# EAGLE schematic Schematic (EAGLE 9.6.2)
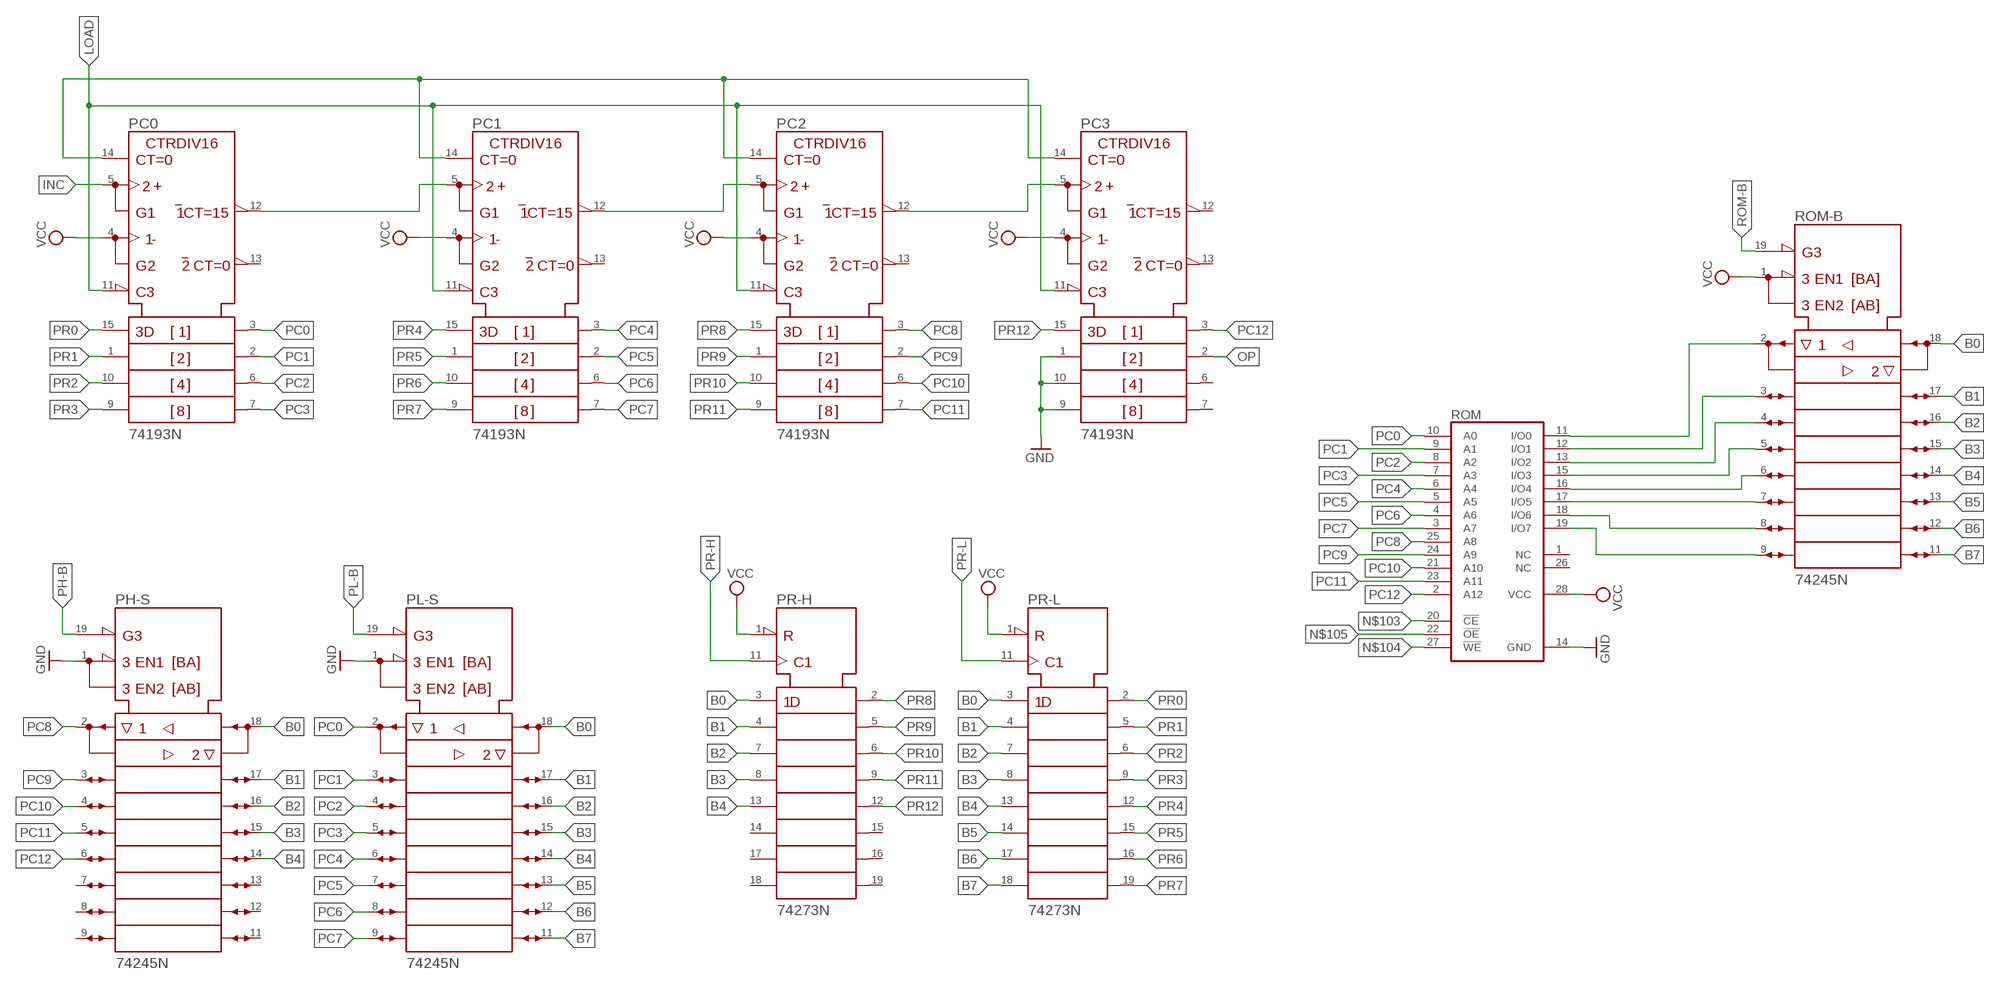
[diagram p0: schematic, sheet 1, part 1 of 3]
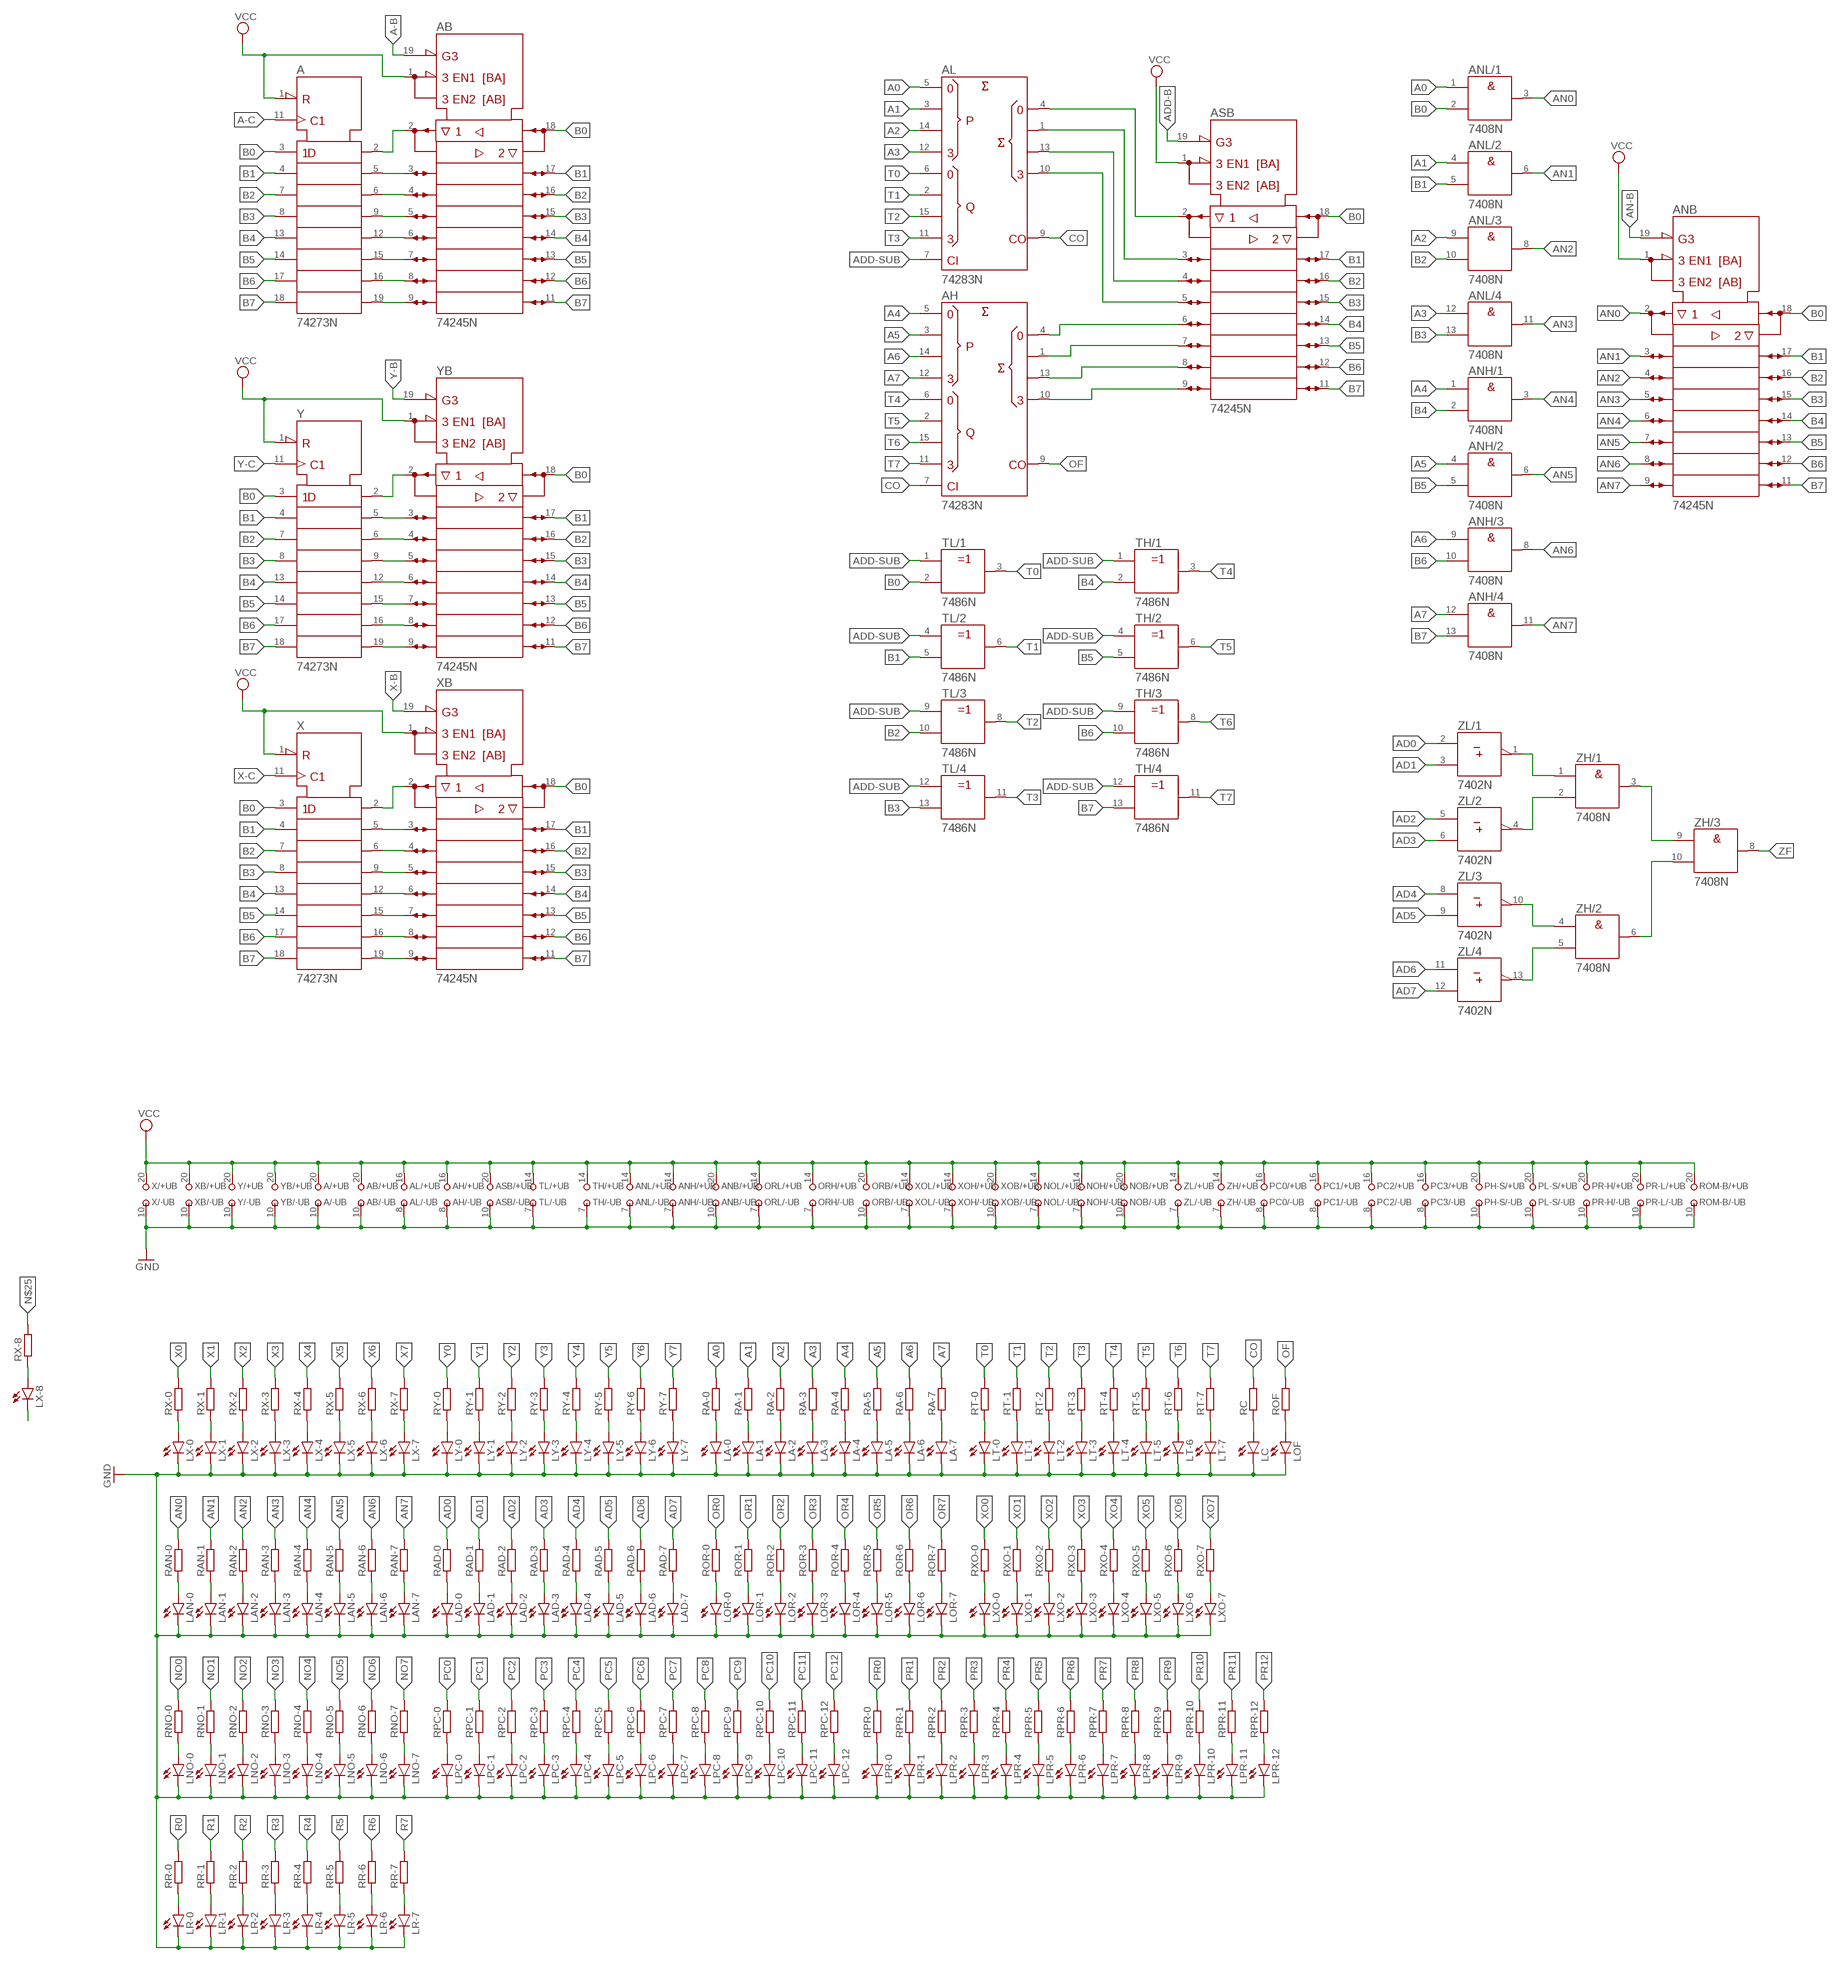
[diagram p1: schematic, sheet 1, part 2 of 3]
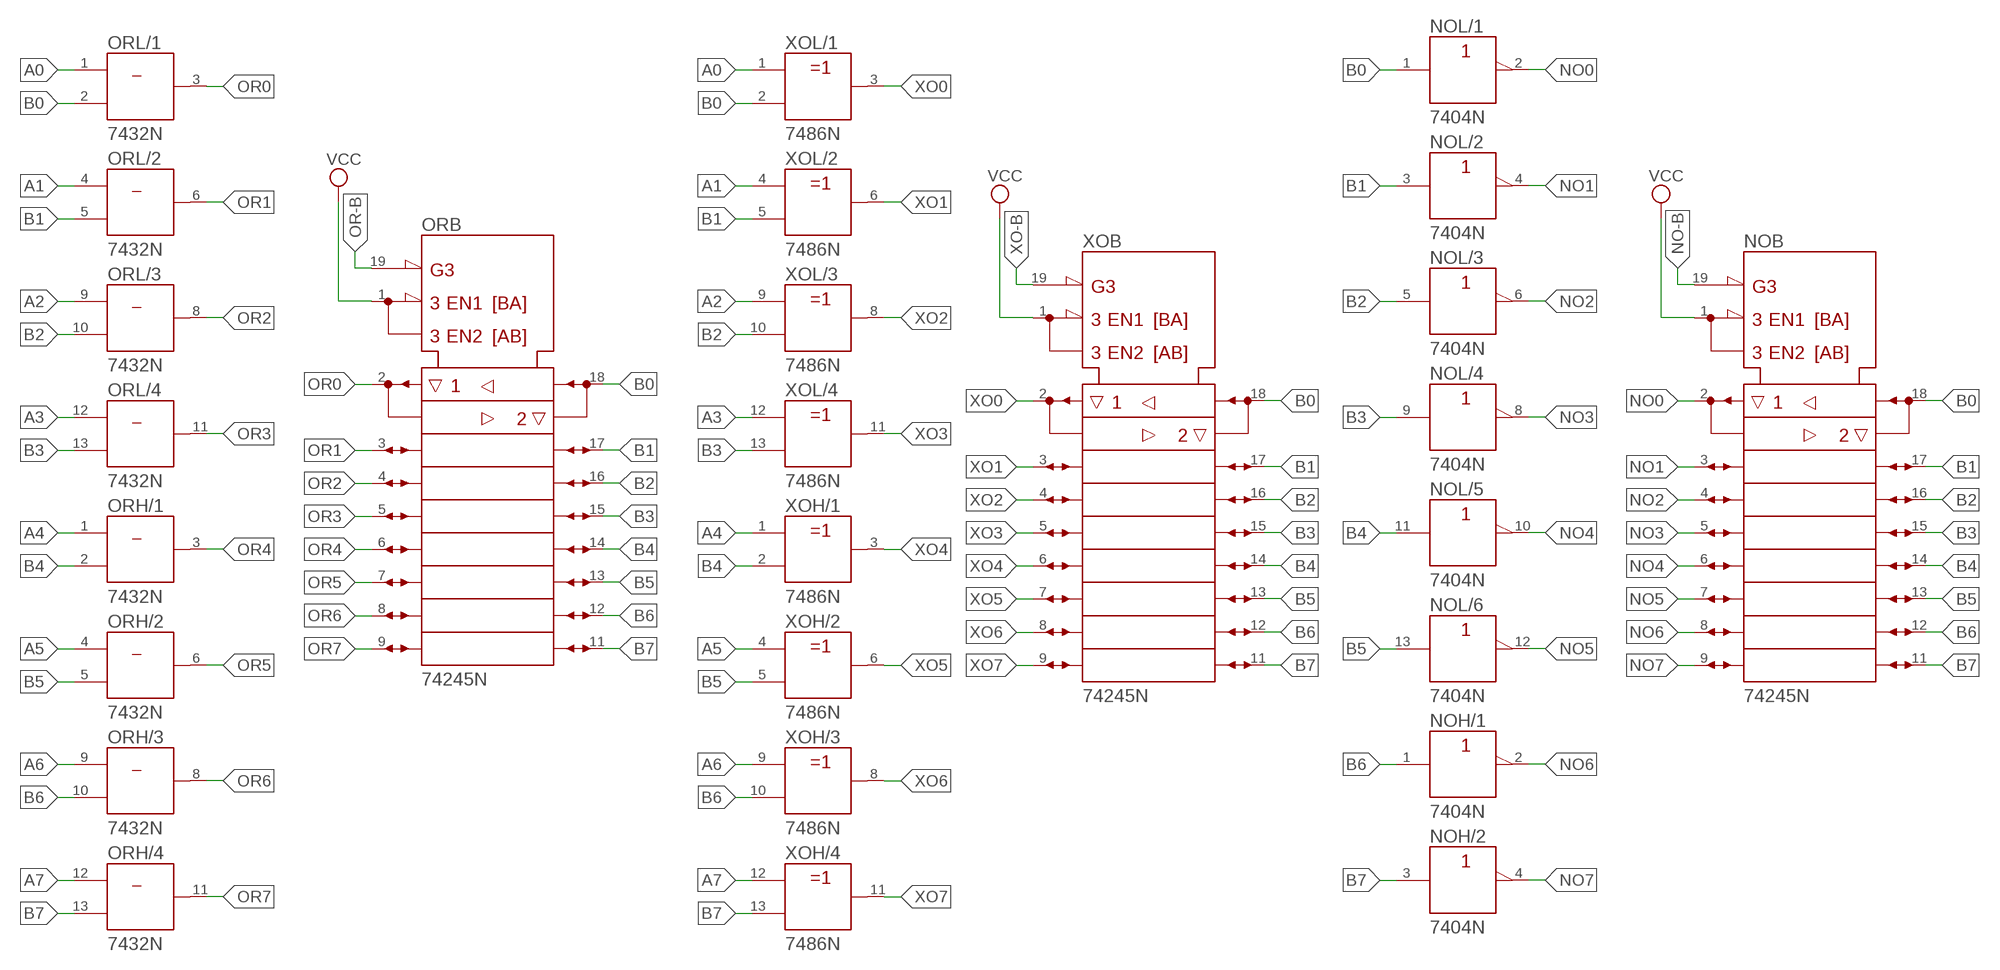
[diagram p2: schematic, sheet 1, part 3 of 3]

## Parts
A  74273N  [DIL20]
AB  74245N  [DIL20]
AH  74283N  [DIL16]
AL  74283N  [DIL16]
ANB  74245N  [DIL20]
ANH  7408N  [DIL14]
ANL  7408N  [DIL14]
ASB  74245N  [DIL20]
LA-0  LED5MM  [LED5MM]
LA-1  LED5MM  [LED5MM]
LA-2  LED5MM  [LED5MM]
LA-3  LED5MM  [LED5MM]
LA-4  LED5MM  [LED5MM]
LA-5  LED5MM  [LED5MM]
LA-6  LED5MM  [LED5MM]
LA-7  LED5MM  [LED5MM]
LAD-0  LED5MM  [LED5MM]
LAD-1  LED5MM  [LED5MM]
LAD-2  LED5MM  [LED5MM]
LAD-3  LED5MM  [LED5MM]
LAD-4  LED5MM  [LED5MM]
LAD-5  LED5MM  [LED5MM]
LAD-6  LED5MM  [LED5MM]
LAD-7  LED5MM  [LED5MM]
LAN-0  LED5MM  [LED5MM]
LAN-1  LED5MM  [LED5MM]
LAN-2  LED5MM  [LED5MM]
LAN-3  LED5MM  [LED5MM]
LAN-4  LED5MM  [LED5MM]
LAN-5  LED5MM  [LED5MM]
LAN-6  LED5MM  [LED5MM]
LAN-7  LED5MM  [LED5MM]
LC  LED5MM  [LED5MM]
LNO-0  LED5MM  [LED5MM]
LNO-1  LED5MM  [LED5MM]
LNO-2  LED5MM  [LED5MM]
LNO-3  LED5MM  [LED5MM]
LNO-4  LED5MM  [LED5MM]
LNO-5  LED5MM  [LED5MM]
LNO-6  LED5MM  [LED5MM]
LNO-7  LED5MM  [LED5MM]
LOF  LED5MM  [LED5MM]
LOR-0  LED5MM  [LED5MM]
LOR-1  LED5MM  [LED5MM]
LOR-2  LED5MM  [LED5MM]
LOR-3  LED5MM  [LED5MM]
LOR-4  LED5MM  [LED5MM]
LOR-5  LED5MM  [LED5MM]
LOR-6  LED5MM  [LED5MM]
LOR-7  LED5MM  [LED5MM]
LPC-0  LED5MM  [LED5MM]
LPC-1  LED5MM  [LED5MM]
LPC-2  LED5MM  [LED5MM]
LPC-3  LED5MM  [LED5MM]
LPC-4  LED5MM  [LED5MM]
LPC-5  LED5MM  [LED5MM]
LPC-6  LED5MM  [LED5MM]
LPC-7  LED5MM  [LED5MM]
LPC-8  LED5MM  [LED5MM]
LPC-9  LED5MM  [LED5MM]
LPC-10  LED5MM  [LED5MM]
LPC-11  LED5MM  [LED5MM]
LPC-12  LED5MM  [LED5MM]
LPR-0  LED5MM  [LED5MM]
LPR-1  LED5MM  [LED5MM]
LPR-2  LED5MM  [LED5MM]
LPR-3  LED5MM  [LED5MM]
LPR-4  LED5MM  [LED5MM]
LPR-5  LED5MM  [LED5MM]
LPR-6  LED5MM  [LED5MM]
LPR-7  LED5MM  [LED5MM]
LPR-8  LED5MM  [LED5MM]
LPR-9  LED5MM  [LED5MM]
LPR-10  LED5MM  [LED5MM]
LPR-11  LED5MM  [LED5MM]
LPR-12  LED5MM  [LED5MM]
LR-0  LED5MM  [LED5MM]
LR-1  LED5MM  [LED5MM]
LR-2  LED5MM  [LED5MM]
LR-3  LED5MM  [LED5MM]
LR-4  LED5MM  [LED5MM]
LR-5  LED5MM  [LED5MM]
LR-6  LED5MM  [LED5MM]
LR-7  LED5MM  [LED5MM]
LT-0  LED5MM  [LED5MM]
LT-1  LED5MM  [LED5MM]
LT-2  LED5MM  [LED5MM]
LT-3  LED5MM  [LED5MM]
LT-4  LED5MM  [LED5MM]
LT-5  LED5MM  [LED5MM]
LT-6  LED5MM  [LED5MM]
LT-7  LED5MM  [LED5MM]
LX-0  LED5MM  [LED5MM]
LX-1  LED5MM  [LED5MM]
LX-2  LED5MM  [LED5MM]
LX-3  LED5MM  [LED5MM]
LX-4  LED5MM  [LED5MM]
LX-5  LED5MM  [LED5MM]
LX-6  LED5MM  [LED5MM]
LX-7  LED5MM  [LED5MM]
LX-8  LED5MM  [LED5MM]
LXO-0  LED5MM  [LED5MM]
LXO-1  LED5MM  [LED5MM]
LXO-2  LED5MM  [LED5MM]
LXO-3  LED5MM  [LED5MM]
LXO-4  LED5MM  [LED5MM]
LXO-5  LED5MM  [LED5MM]
LXO-6  LED5MM  [LED5MM]
LXO-7  LED5MM  [LED5MM]
LY-0  LED5MM  [LED5MM]
LY-1  LED5MM  [LED5MM]
LY-2  LED5MM  [LED5MM]
LY-3  LED5MM  [LED5MM]
LY-4  LED5MM  [LED5MM]
LY-5  LED5MM  [LED5MM]
LY-6  LED5MM  [LED5MM]
LY-7  LED5MM  [LED5MM]
NOB  74245N  [DIL20]
NOH  7404N  [DIL14]
NOL  7404N  [DIL14]
ORB  74245N  [DIL20]
ORH  7432N  [DIL14]
ORL  7432N  [DIL14]
PC0  74193N  [DIL16]
PC1  74193N  [DIL16]
PC2  74193N  [DIL16]
PC3  74193N  [DIL16]
PH-S  74245N  [DIL20]
PL-S  74245N  [DIL20]
PR-H  74273N  [DIL20]
PR-L  74273N  [DIL20]
RA-0  R-EU_0207/10  [0207/10]
RA-1  R-EU_0207/10  [0207/10]
RA-2  R-EU_0207/10  [0207/10]
RA-3  R-EU_0207/10  [0207/10]
RA-4  R-EU_0207/10  [0207/10]
RA-5  R-EU_0207/10  [0207/10]
RA-6  R-EU_0207/10  [0207/10]
RA-7  R-EU_0207/10  [0207/10]
RAD-0  R-EU_0207/10  [0207/10]
RAD-1  R-EU_0207/10  [0207/10]
RAD-2  R-EU_0207/10  [0207/10]
RAD-3  R-EU_0207/10  [0207/10]
RAD-4  R-EU_0207/10  [0207/10]
RAD-5  R-EU_0207/10  [0207/10]
RAD-6  R-EU_0207/10  [0207/10]
RAD-7  R-EU_0207/10  [0207/10]
RAN-0  R-EU_0207/10  [0207/10]
RAN-1  R-EU_0207/10  [0207/10]
RAN-2  R-EU_0207/10  [0207/10]
RAN-3  R-EU_0207/10  [0207/10]
RAN-4  R-EU_0207/10  [0207/10]
RAN-5  R-EU_0207/10  [0207/10]
RAN-6  R-EU_0207/10  [0207/10]
RAN-7  R-EU_0207/10  [0207/10]
RC  R-EU_0207/10  [0207/10]
RNO-0  R-EU_0207/10  [0207/10]
RNO-1  R-EU_0207/10  [0207/10]
RNO-2  R-EU_0207/10  [0207/10]
RNO-3  R-EU_0207/10  [0207/10]
RNO-4  R-EU_0207/10  [0207/10]
RNO-5  R-EU_0207/10  [0207/10]
RNO-6  R-EU_0207/10  [0207/10]
RNO-7  R-EU_0207/10  [0207/10]
ROF  R-EU_0207/10  [0207/10]
ROM  28C64C  [DIL28-6]
ROM-B  74245N  [DIL20]
ROR-0  R-EU_0207/10  [0207/10]
ROR-1  R-EU_0207/10  [0207/10]
ROR-2  R-EU_0207/10  [0207/10]
ROR-3  R-EU_0207/10  [0207/10]
ROR-4  R-EU_0207/10  [0207/10]
ROR-5  R-EU_0207/10  [0207/10]
ROR-6  R-EU_0207/10  [0207/10]
ROR-7  R-EU_0207/10  [0207/10]
RPC-0  R-EU_0207/10  [0207/10]
RPC-1  R-EU_0207/10  [0207/10]
RPC-2  R-EU_0207/10  [0207/10]
RPC-3  R-EU_0207/10  [0207/10]
RPC-4  R-EU_0207/10  [0207/10]
RPC-5  R-EU_0207/10  [0207/10]
RPC-6  R-EU_0207/10  [0207/10]
RPC-7  R-EU_0207/10  [0207/10]
RPC-8  R-EU_0207/10  [0207/10]
RPC-9  R-EU_0207/10  [0207/10]
RPC-10  R-EU_0207/10  [0207/10]
RPC-11  R-EU_0207/10  [0207/10]
RPC-12  R-EU_0207/10  [0207/10]
RPR-0  R-EU_0207/10  [0207/10]
RPR-1  R-EU_0207/10  [0207/10]
RPR-2  R-EU_0207/10  [0207/10]
RPR-3  R-EU_0207/10  [0207/10]
RPR-4  R-EU_0207/10  [0207/10]
RPR-5  R-EU_0207/10  [0207/10]
RPR-6  R-EU_0207/10  [0207/10]
RPR-7  R-EU_0207/10  [0207/10]
RPR-8  R-EU_0207/10  [0207/10]
RPR-9  R-EU_0207/10  [0207/10]
RPR-10  R-EU_0207/10  [0207/10]
RPR-11  R-EU_0207/10  [0207/10]
RPR-12  R-EU_0207/10  [0207/10]
RR-0  R-EU_0207/10  [0207/10]
RR-1  R-EU_0207/10  [0207/10]
RR-2  R-EU_0207/10  [0207/10]
RR-3  R-EU_0207/10  [0207/10]
RR-4  R-EU_0207/10  [0207/10]
RR-5  R-EU_0207/10  [0207/10]
RR-6  R-EU_0207/10  [0207/10]
RR-7  R-EU_0207/10  [0207/10]
RT-0  R-EU_0207/10  [0207/10]
RT-1  R-EU_0207/10  [0207/10]
RT-2  R-EU_0207/10  [0207/10]
RT-3  R-EU_0207/10  [0207/10]
RT-4  R-EU_0207/10  [0207/10]
RT-5  R-EU_0207/10  [0207/10]
RT-6  R-EU_0207/10  [0207/10]
RT-7  R-EU_0207/10  [0207/10]
RX-0  R-EU_0207/10  [0207/10]
RX-1  R-EU_0207/10  [0207/10]
RX-2  R-EU_0207/10  [0207/10]
RX-3  R-EU_0207/10  [0207/10]
RX-4  R-EU_0207/10  [0207/10]
RX-5  R-EU_0207/10  [0207/10]
RX-6  R-EU_0207/10  [0207/10]
RX-7  R-EU_0207/10  [0207/10]
RX-8  R-EU_0207/10  [0207/10]
RXO-0  R-EU_0207/10  [0207/10]
RXO-1  R-EU_0207/10  [0207/10]
RXO-2  R-EU_0207/10  [0207/10]
RXO-3  R-EU_0207/10  [0207/10]
RXO-4  R-EU_0207/10  [0207/10]
RXO-5  R-EU_0207/10  [0207/10]
RXO-6  R-EU_0207/10  [0207/10]
RXO-7  R-EU_0207/10  [0207/10]
RY-0  R-EU_0207/10  [0207/10]
RY-1  R-EU_0207/10  [0207/10]
RY-2  R-EU_0207/10  [0207/10]
RY-3  R-EU_0207/10  [0207/10]
RY-4  R-EU_0207/10  [0207/10]
RY-5  R-EU_0207/10  [0207/10]
RY-6  R-EU_0207/10  [0207/10]
RY-7  R-EU_0207/10  [0207/10]
TH  7486N  [DIL14]
TL  7486N  [DIL14]
X  74273N  [DIL20]
XB  74245N  [DIL20]
XOB  74245N  [DIL20]
XOH  7486N  [DIL14]
XOL  7486N  [DIL14]
Y  74273N  [DIL20]
YB  74245N  [DIL20]
ZH  7408N  [DIL14]
ZL  7402N  [DIL14]

## Nets
A0: A.2(1Q) AB.2(A1) AL.5(A1) ANL.1(/1:A) ORL.1(/1:A) RA-0.2 XOL.1(/1:A)
A1: A.5(2Q) AB.3(A2) AL.3(A2) ANL.4(/2:A) ORL.4(/2:A) RA-1.2 XOL.4(/2:A)
A2: A.6(3Q) AB.4(A3) AL.14(A3) ANL.9(/3:A) ORL.9(/3:A) RA-2.2 XOL.9(/3:A)
A3: A.9(4Q) AB.5(A4) AL.12(A4) ANL.12(/4:A) ORL.12(/4:A) RA-3.2 XOL.12(/4:A)
A4: A.12(5Q) AB.6(A5) AH.5(A1) ANH.1(/1:A) ORH.1(/1:A) RA-4.2 XOH.1(/1:A)
A5: A.15(6Q) AB.7(A6) AH.3(A2) ANH.4(/2:A) ORH.4(/2:A) RA-5.2 XOH.4(/2:A)
A6: A.16(7Q) AB.8(A7) AH.14(A3) ANH.9(/3:A) ORH.9(/3:A) RA-6.2 XOH.9(/3:A)
A7: A.19(8Q) AB.9(A8) AH.12(A4) ANH.12(/4:A) ORH.12(/4:A) RA-7.2 XOH.12(/4:A)
A-B: AB.19(!G)
A-C: A.11(CLK)
AD0: AL.4(S1) ASB.2(A1) RAD-0.2 ZL.2(/1:A)
AD1: AL.1(S2) ASB.3(A2) RAD-1.2 ZL.3(/1:B)
AD2: AL.13(S3) ASB.4(A3) RAD-2.2 ZL.5(/2:A)
AD3: AL.10(S4) ASB.5(A4) RAD-3.2 ZL.6(/2:B)
AD4: AH.4(S1) ASB.6(A5) RAD-4.2 ZL.8(/3:A)
AD5: AH.1(S2) ASB.7(A6) RAD-5.2 ZL.9(/3:B)
AD6: AH.13(S3) ASB.8(A7) RAD-6.2 ZL.11(/4:A)
AD7: AH.10(S4) ASB.9(A8) RAD-7.2 ZL.12(/4:B)
ADD-B: ASB.19(!G)
ADD-SUB: AL.7(C0) TH.1(/1:A) TH.4(/2:A) TH.9(/3:A) TH.12(/4:A) TL.1(/1:A) TL.4(/2:A) TL.9(/3:A) TL.12(/4:A)
AN0: ANB.2(A1) ANL.3(/1:Y) RAN-0.2
AN1: ANB.3(A2) ANL.6(/2:Y) RAN-1.2
AN2: ANB.4(A3) ANL.8(/3:Y) RAN-2.2
AN3: ANB.5(A4) ANL.11(/4:Y) RAN-3.2
AN4: ANB.6(A5) ANH.3(/1:Y) RAN-4.2
AN5: ANB.7(A6) ANH.6(/2:Y) RAN-5.2
AN6: ANB.8(A7) ANH.8(/3:Y) RAN-6.2
AN7: ANB.9(A8) ANH.11(/4:Y) RAN-7.2
AN-B: ANB.19(!G)
B0: A.3(1D) AB.18(B1) ANB.18(B1) ANL.2(/1:B) ASB.18(B1) NOB.18(B1) NOL.1(/1:A) ORB.18(B1) ORL.2(/1:B) PH-S.18(B1) PL-S.18(B1) PR-H.3(1D) PR-L.3(1D) ROM-B.18(B1) TL.2(/1:B) X.3(1D) XB.18(B1) XOB.18(B1) XOL.2(/1:B) Y.3(1D) YB.18(B1)
B1: A.4(2D) AB.17(B2) ANB.17(B2) ANL.5(/2:B) ASB.17(B2) NOB.17(B2) NOL.3(/2:A) ORB.17(B2) ORL.5(/2:B) PH-S.17(B2) PL-S.17(B2) PR-H.4(2D) PR-L.4(2D) ROM-B.17(B2) TL.5(/2:B) X.4(2D) XB.17(B2) XOB.17(B2) XOL.5(/2:B) Y.4(2D) YB.17(B2)
B2: A.7(3D) AB.16(B3) ANB.16(B3) ANL.10(/3:B) ASB.16(B3) NOB.16(B3) NOL.5(/3:A) ORB.16(B3) ORL.10(/3:B) PH-S.16(B3) PL-S.16(B3) PR-H.7(3D) PR-L.7(3D) ROM-B.16(B3) TL.10(/3:B) X.7(3D) XB.16(B3) XOB.16(B3) XOL.10(/3:B) Y.7(3D) YB.16(B3)
B3: A.8(4D) AB.15(B4) ANB.15(B4) ANL.13(/4:B) ASB.15(B4) NOB.15(B4) NOL.9(/4:A) ORB.15(B4) ORL.13(/4:B) PH-S.15(B4) PL-S.15(B4) PR-H.8(4D) PR-L.8(4D) ROM-B.15(B4) TL.13(/4:B) X.8(4D) XB.15(B4) XOB.15(B4) XOL.13(/4:B) Y.8(4D) YB.15(B4)
B4: A.13(5D) AB.14(B5) ANB.14(B5) ANH.2(/1:B) ASB.14(B5) NOB.14(B5) NOL.11(/5:A) ORB.14(B5) ORH.2(/1:B) PH-S.14(B5) PL-S.14(B5) PR-H.13(5D) PR-L.13(5D) ROM-B.14(B5) TH.2(/1:B) X.13(5D) XB.14(B5) XOB.14(B5) XOH.2(/1:B) Y.13(5D) YB.14(B5)
B5: A.14(6D) AB.13(B6) ANB.13(B6) ANH.5(/2:B) ASB.13(B6) NOB.13(B6) NOL.13(/6:A) ORB.13(B6) ORH.5(/2:B) PL-S.13(B6) PR-L.14(6D) ROM-B.13(B6) TH.5(/2:B) X.14(6D) XB.13(B6) XOB.13(B6) XOH.5(/2:B) Y.14(6D) YB.13(B6)
B6: A.17(7D) AB.12(B7) ANB.12(B7) ANH.10(/3:B) ASB.12(B7) NOB.12(B7) NOH.1(/1:A) ORB.12(B7) ORH.10(/3:B) PL-S.12(B7) PR-L.17(7D) ROM-B.12(B7) TH.10(/3:B) X.17(7D) XB.12(B7) XOB.12(B7) XOH.10(/3:B) Y.17(7D) YB.12(B7)
B7: A.18(8D) AB.11(B8) ANB.11(B8) ANH.13(/4:B) ASB.11(B8) NOB.11(B8) NOH.3(/2:A) ORB.11(B8) ORH.13(/4:B) PL-S.11(B8) PR-L.18(8D) ROM-B.11(B8) TH.13(/4:B) X.18(8D) XB.11(B8) XOB.11(B8) XOH.13(/4:B) Y.18(8D) YB.11(B8)
CO: AH.7(C0) AL.9(C4) RC.2
GND: A.10(-UB) AB.10(-UB) AH.8(-UB) AL.8(-UB) ANB.10(-UB) ANH.7(/-UB:-UB) ANL.7(/-UB:-UB) ASB.10(-UB) LA-0.K(C) LA-1.K(C) LA-2.K(C) LA-3.K(C) LA-4.K(C) LA-5.K(C) LA-6.K(C) LA-7.K(C) LAD-0.K(C) LAD-1.K(C) LAD-2.K(C) LAD-3.K(C) LAD-4.K(C) LAD-5.K(C) LAD-6.K(C) LAD-7.K(C) LAN-0.K(C) LAN-1.K(C) LAN-2.K(C) LAN-3.K(C) LAN-4.K(C) LAN-5.K(C) LAN-6.K(C) LAN-7.K(C) LC.K(C) LNO-0.K(C) LNO-1.K(C) LNO-2.K(C) LNO-3.K(C) LNO-4.K(C) LNO-5.K(C) LNO-6.K(C) LNO-7.K(C) LOF.K(C) LOR-0.K(C) LOR-1.K(C) LOR-2.K(C) LOR-3.K(C) LOR-4.K(C) LOR-5.K(C) LOR-6.K(C) LOR-7.K(C) LPC-0.K(C) LPC-1.K(C) LPC-2.K(C) LPC-3.K(C) LPC-4.K(C) LPC-5.K(C) LPC-6.K(C) LPC-7.K(C) LPC-8.K(C) LPC-9.K(C) LPC-10.K(C) LPC-11.K(C) LPC-12.K(C) LPR-0.K(C) LPR-1.K(C) LPR-2.K(C) LPR-3.K(C) LPR-4.K(C) LPR-5.K(C) LPR-6.K(C) LPR-7.K(C) LPR-8.K(C) LPR-9.K(C) LPR-10.K(C) LPR-11.K(C) LPR-12.K(C) LR-0.K(C) LR-1.K(C) LR-2.K(C) LR-3.K(C) LR-4.K(C) LR-5.K(C) LR-6.K(C) LR-7.K(C) LT-0.K(C) LT-1.K(C) LT-2.K(C) LT-3.K(C) LT-4.K(C) LT-5.K(C) LT-6.K(C) LT-7.K(C) LX-0.K(C) LX-1.K(C) LX-2.K(C) LX-3.K(C) LX-4.K(C) LX-5.K(C) LX-6.K(C) LX-7.K(C) LXO-0.K(C) LXO-1.K(C) LXO-2.K(C) LXO-3.K(C) LXO-4.K(C) LXO-5.K(C) LXO-6.K(C) LXO-7.K(C) LY-0.K(C) LY-1.K(C) LY-2.K(C) LY-3.K(C) LY-4.K(C) LY-5.K(C) LY-6.K(C) LY-7.K(C) NOB.10(-UB) NOH.7(/-UB:-UB) NOL.7(/-UB:-UB) ORB.10(-UB) ORH.7(/-UB:-UB) ORL.7(/-UB:-UB) PC0.8(-UB) PC1.8(-UB) PC2.8(-UB) PC3.1(B) PC3.8(-UB) PC3.9(D) PC3.10(C) PH-S.1(DIR) PH-S.10(-UB) PL-S.1(DIR) PL-S.10(-UB) PR-H.10(-UB) PR-L.10(-UB) ROM-B.10(-UB) ROM.14(GND) TH.7(/-UB:-UB) TL.7(/-UB:-UB) X.10(-UB) XB.10(-UB) XOB.10(-UB) XOH.7(/-UB:-UB) XOL.7(/-UB:-UB) Y.10(-UB) YB.10(-UB) ZH.7(/-UB:-UB) ZL.7(/-UB:-UB)
GND1: LX-8.K(C)
INC: PC0.5(UP)
LOAD: PC0.11(!LOAD) PC1.11(!LOAD) PC2.11(!LOAD) PC3.11(!LOAD)
N$1: LC.A RC.1
N$2: LX-0.A RX-0.1
N$3: LA-0.A RA-0.1
N$4: LT-0.A RT-0.1
N$5: LX-1.A RX-1.1
N$6: LY-0.A RY-0.1
N$7: LA-1.A RA-1.1
N$8: LX-2.A RX-2.1
N$9: LOF.A ROF.1
N$10: LA-2.A RA-2.1
N$11: LX-3.A RX-3.1
N$12: LY-1.A RY-1.1
N$13: LT-1.A RT-1.1
N$14: LX-4.A RX-4.1
N$15: LA-3.A RA-3.1
N$16: LAN-1.A RAN-1.1
N$17: LX-5.A RX-5.1
N$18: LY-2.A RY-2.1
N$19: LA-4.A RA-4.1
N$20: LX-6.A RX-6.1
N$21: LT-2.A RT-2.1
N$22: LA-5.A RA-5.1
N$23: LX-7.A RX-7.1
N$24: LY-3.A RY-3.1
N$25: RX-8.2
N$26: LX-8.A RX-8.1
N$27: LAN-0.A RAN-0.1
N$28: LY-4.A RY-4.1
N$29: LA-6.A RA-6.1
N$30: LY-5.A RY-5.1
N$31: LT-3.A RT-3.1
N$32: LY-6.A RY-6.1
N$33: LA-7.A RA-7.1
N$34: LY-7.A RY-7.1
N$35: LAN-2.A RAN-2.1
N$36: LT-4.A RT-4.1
N$37: LAN-3.A RAN-3.1
N$38: LT-5.A RT-5.1
N$39: LAN-4.A RAN-4.1
N$40: LT-6.A RT-6.1
N$41: LAN-5.A RAN-5.1
N$42: LT-7.A RT-7.1
N$43: LAN-6.A RAN-6.1
N$44: LAN-7.A RAN-7.1
N$45: LAD-0.A RAD-0.1
N$46: LAD-1.A RAD-1.1
N$47: LAD-2.A RAD-2.1
N$48: LAD-3.A RAD-3.1
N$49: LAD-4.A RAD-4.1
N$50: LAD-5.A RAD-5.1
N$51: LAD-6.A RAD-6.1
N$52: LAD-7.A RAD-7.1
N$53: LXO-0.A RXO-0.1
N$54: LXO-1.A RXO-1.1
N$55: LXO-2.A RXO-2.1
N$56: LXO-3.A RXO-3.1
N$57: LXO-4.A RXO-4.1
N$58: LXO-5.A RXO-5.1
N$59: LXO-6.A RXO-6.1
N$60: LXO-7.A RXO-7.1
N$61: LNO-0.A RNO-0.1
N$62: LNO-1.A RNO-1.1
N$63: LNO-2.A RNO-2.1
N$64: LNO-3.A RNO-3.1
N$65: LNO-4.A RNO-4.1
N$66: LNO-5.A RNO-5.1
N$67: LNO-6.A RNO-6.1
N$68: LNO-7.A RNO-7.1
N$69: LPC-0.A RPC-0.1
N$70: LPC-1.A RPC-1.1
N$71: LPC-2.A RPC-2.1
N$72: LPC-3.A RPC-3.1
N$73: LPC-4.A RPC-4.1
N$74: LPC-5.A RPC-5.1
N$75: LPC-6.A RPC-6.1
N$76: LPC-7.A RPC-7.1
N$77: ZH.5(/2:B) ZL.13(/4:Y)
N$78: ZH.4(/2:A) ZL.10(/3:Y)
N$79: ZH.2(/1:B) ZL.4(/2:Y)
N$80: ZH.1(/1:A) ZL.1(/1:Y)
N$81: ZH.3(/1:Y) ZH.9(/3:A)
N$82: ZH.6(/2:Y) ZH.10(/3:B)
N$83: LPC-8.A RPC-8.1
N$84: LPC-9.A RPC-9.1
N$85: LPC-10.A RPC-10.1
N$86: LPC-11.A RPC-11.1
N$87: LPC-12.A RPC-12.1
N$88: LPR-0.A RPR-0.1
N$89: LPR-1.A RPR-1.1
N$90: LPR-2.A RPR-2.1
N$91: LPR-3.A RPR-3.1
N$92: LPR-4.A RPR-4.1
N$93: LPR-5.A RPR-5.1
N$94: LOR-1.A ROR-1.1
N$95: LOR-0.A ROR-0.1
N$96: LOR-2.A ROR-2.1
N$97: LOR-3.A ROR-3.1
N$98: LOR-4.A ROR-4.1
N$99: LOR-5.A ROR-5.1
N$100: LOR-6.A ROR-6.1
N$101: LOR-7.A ROR-7.1
N$102: LPR-6.A RPR-6.1
N$103: ROM.20(!CE)
N$104: ROM.27(!WE)
N$105: ROM.22(!OE)
N$106: LPR-7.A RPR-7.1
N$107: LPR-8.A RPR-8.1
N$108: LPR-9.A RPR-9.1
N$109: LPR-10.A RPR-10.1
N$110: LPR-11.A RPR-11.1
N$111: LPR-12.A RPR-12.1
N$112: LR-0.A RR-0.1
N$113: LR-1.A RR-1.1
N$114: LR-2.A RR-2.1
N$115: LR-3.A RR-3.1
N$116: PC2.12(!CO) PC3.5(UP)
N$117: LR-4.A RR-4.1
N$118: LR-5.A RR-5.1
N$119: LR-6.A RR-6.1
N$120: PC0.12(!CO) PC1.5(UP)
N$121: PC0.14(CLR) PC1.14(CLR) PC2.14(CLR) PC3.14(CLR)
N$122: PC1.12(!CO) PC2.5(UP)
N$123: LR-7.A RR-7.1
NO0: NOB.2(A1) NOL.2(/1:Y) RNO-0.2
NO1: NOB.3(A2) NOL.4(/2:Y) RNO-1.2
NO2: NOB.4(A3) NOL.6(/3:Y) RNO-2.2
NO3: NOB.5(A4) NOL.8(/4:Y) RNO-3.2
NO4: NOB.6(A5) NOL.10(/5:Y) RNO-4.2
NO5: NOB.7(A6) NOL.12(/6:Y) RNO-5.2
NO6: NOB.8(A7) NOH.2(/1:Y) RNO-6.2
NO7: NOB.9(A8) NOH.4(/2:Y) RNO-7.2
NO-B: NOB.19(!G)
OF: AH.9(C4) ROF.2
OP: PC3.2(QB)
OR0: ORB.2(A1) ORL.3(/1:Y) ROR-0.2
OR1: ORB.3(A2) ORL.6(/2:Y) ROR-1.2
OR2: ORB.4(A3) ORL.8(/3:Y) ROR-2.2
OR3: ORB.5(A4) ORL.11(/4:Y) ROR-3.2
OR4: ORB.6(A5) ORH.3(/1:Y) ROR-4.2
OR5: ORB.7(A6) ORH.6(/2:Y) ROR-5.2
OR6: ORB.8(A7) ORH.8(/3:Y) ROR-6.2
OR7: ORB.9(A8) ORH.11(/4:Y) ROR-7.2
OR-B: ORB.19(!G)
PC0: PC0.3(QA) PL-S.2(A1) ROM.10(A0) RPC-0.2
PC1: PC0.2(QB) PL-S.3(A2) ROM.9(A1) RPC-1.2
PC2: PC0.6(QC) PL-S.4(A3) ROM.8(A2) RPC-2.2
PC3: PC0.7(QD) PL-S.5(A4) ROM.7(A3) RPC-3.2
PC4: PC1.3(QA) PL-S.6(A5) ROM.6(A4) RPC-4.2
PC5: PC1.2(QB) PL-S.7(A6) ROM.5(A5) RPC-5.2
PC6: PC1.6(QC) PL-S.8(A7) ROM.4(A6) RPC-6.2
PC7: PC1.7(QD) PL-S.9(A8) ROM.3(A7) RPC-7.2
PC8: PC2.3(QA) PH-S.2(A1) ROM.25(A8) RPC-8.2
PC9: PC2.2(QB) PH-S.3(A2) ROM.24(A9) RPC-9.2
PC10: PC2.6(QC) PH-S.4(A3) ROM.21(A10) RPC-10.2
PC11: PC2.7(QD) PH-S.5(A4) ROM.23(A11) RPC-11.2
PC12: PC3.3(QA) PH-S.6(A5) ROM.2(A12) RPC-12.2
PH-B: PH-S.19(!G)
PL-B: PL-S.19(!G)
PR0: PC0.15(A) PR-L.2(1Q) RPR-0.2
PR1: PC0.1(B) PR-L.5(2Q) RPR-1.2
PR2: PC0.10(C) PR-L.6(3Q) RPR-2.2
PR3: PC0.9(D) PR-L.9(4Q) RPR-3.2
PR4: PC1.15(A) PR-L.12(5Q) RPR-4.2
PR5: PC1.1(B) PR-L.15(6Q) RPR-5.2
PR6: PC1.10(C) PR-L.16(7Q) RPR-6.2
PR7: PC1.9(D) PR-L.19(8Q) RPR-7.2
PR8: PC2.15(A) PR-H.2(1Q) RPR-8.2
PR9: PC2.1(B) PR-H.5(2Q) RPR-9.2
PR10: PC2.10(C) PR-H.6(3Q) RPR-10.2
PR11: PC2.9(D) PR-H.9(4Q) RPR-11.2
PR12: PC3.15(A) PR-H.12(5Q) RPR-12.2
PR-H: PR-H.11(CLK)
PR-L: PR-L.11(CLK)
R0: ROM-B.2(A1) ROM.11(I/O0) RR-0.2
R1: ROM-B.3(A2) ROM.12(I/O1) RR-1.2
R2: ROM-B.4(A3) ROM.13(I/O2) RR-2.2
R3: ROM-B.5(A4) ROM.15(I/O3) RR-3.2
R4: ROM-B.6(A5) ROM.16(I/O4) RR-4.2
R5: ROM-B.7(A6) ROM.17(I/O5) RR-5.2
R6: ROM-B.8(A7) ROM.18(I/O6) RR-6.2
R7: ROM-B.9(A8) ROM.19(I/O7) RR-7.2
ROM-B: ROM-B.19(!G)
T0: AL.6(B1) RT-0.2 TL.3(/1:Y)
T1: AL.2(B2) RT-1.2 TL.6(/2:Y)
T2: AL.15(B3) RT-2.2 TL.8(/3:Y)
T3: AL.11(B4) RT-3.2 TL.11(/4:Y)
T4: AH.6(B1) RT-4.2 TH.3(/1:Y)
T5: AH.2(B2) RT-5.2 TH.6(/2:Y)
T6: AH.15(B3) RT-6.2 TH.8(/3:Y)
T7: AH.11(B4) RT-7.2 TH.11(/4:Y)
VCC: A.1(!CLR) A.20(+UB) AB.1(DIR) AB.20(+UB) AH.16(+UB) AL.16(+UB) ANB.1(DIR) ANB.20(+UB) ANH.14(/+UB:+UB) ANL.14(/+UB:+UB) ASB.1(DIR) ASB.20(+UB) NOB.1(DIR) NOB.20(+UB) NOH.14(/+UB:+UB) NOL.14(/+UB:+UB) ORB.1(DIR) ORB.20(+UB) ORH.14(/+UB:+UB) ORL.14(/+UB:+UB) PC0.4(DOWN) PC0.16(+UB) PC1.4(DOWN) PC1.16(+UB) PC2.4(DOWN) PC2.16(+UB) PC3.4(DOWN) PC3.16(+UB) PH-S.20(+UB) PL-S.20(+UB) PR-H.1(!CLR) PR-H.20(+UB) PR-L.1(!CLR) PR-L.20(+UB) ROM-B.1(DIR) ROM-B.20(+UB) ROM.28(VCC) TH.14(/+UB:+UB) TL.14(/+UB:+UB) X.1(!CLR) X.20(+UB) XB.1(DIR) XB.20(+UB) XOB.1(DIR) XOB.20(+UB) XOH.14(/+UB:+UB) XOL.14(/+UB:+UB) Y.1(!CLR) Y.20(+UB) YB.1(DIR) YB.20(+UB) ZH.14(/+UB:+UB) ZL.14(/+UB:+UB)
X0: RX-0.2 X.2(1Q) XB.2(A1)
X1: RX-1.2 X.5(2Q) XB.3(A2)
X2: RX-2.2 X.6(3Q) XB.4(A3)
X3: RX-3.2 X.9(4Q) XB.5(A4)
X4: RX-4.2 X.12(5Q) XB.6(A5)
X5: RX-5.2 X.15(6Q) XB.7(A6)
X6: RX-6.2 X.16(7Q) XB.8(A7)
X7: RX-7.2 X.19(8Q) XB.9(A8)
X-B: XB.19(!G)
X-C: X.11(CLK)
XO0: RXO-0.2 XOB.2(A1) XOL.3(/1:Y)
XO1: RXO-1.2 XOB.3(A2) XOL.6(/2:Y)
XO2: RXO-2.2 XOB.4(A3) XOL.8(/3:Y)
XO3: RXO-3.2 XOB.5(A4) XOL.11(/4:Y)
XO4: RXO-4.2 XOB.6(A5) XOH.3(/1:Y)
XO5: RXO-5.2 XOB.7(A6) XOH.6(/2:Y)
XO6: RXO-6.2 XOB.8(A7) XOH.8(/3:Y)
XO7: RXO-7.2 XOB.9(A8) XOH.11(/4:Y)
XO-B: XOB.19(!G)
Y0: RY-0.2 Y.2(1Q) YB.2(A1)
Y1: RY-1.2 Y.5(2Q) YB.3(A2)
Y2: RY-2.2 Y.6(3Q) YB.4(A3)
Y3: RY-3.2 Y.9(4Q) YB.5(A4)
Y4: RY-4.2 Y.12(5Q) YB.6(A5)
Y5: RY-5.2 Y.15(6Q) YB.7(A6)
Y6: RY-6.2 Y.16(7Q) YB.8(A7)
Y7: RY-7.2 Y.19(8Q) YB.9(A8)
Y-B: YB.19(!G)
Y-C: Y.11(CLK)
ZF: ZH.8(/3:Y)
Unconnected: NOH.5(/3:A) NOH.6(/3:Y) NOH.8(/4:Y) NOH.9(/4:A) NOH.10(/5:Y) NOH.11(/5:A) NOH.12(/6:Y) NOH.13(/6:A) PC0.13(!BO) PC1.13(!BO) PC2.13(!BO) PC3.6(QC) PC3.7(QD) PC3.12(!CO) PC3.13(!BO) PH-S.7(A6) PH-S.8(A7) PH-S.9(A8) PH-S.11(B8) PH-S.12(B7) PH-S.13(B6) PR-H.14(6D) PR-H.15(6Q) PR-H.16(7Q) PR-H.17(7D) PR-H.18(8D) PR-H.19(8Q) ROM.1(NC) ROM.26(NC) ZH.11(/4:Y) ZH.12(/4:A) ZH.13(/4:B)

## Library data of the parts
A PR-H PR-L X Y = 74ttl-din:74*273: Octal D type FLIP FLOP, clear
AB ANB ASB NOB ORB PH-S PL-S ROM-B XB XOB YB = 74ttl-din:74*245: Octal BUS TRANSCEIVER, 3-state
AH AL = 74ttl-din:74*283: 4-bit binary FULL ADDER, fast carry
ANH ANL ZH = 74ttl-din:74*08: Quad 2-input AND gate
LA-0 LA-1-LA-7 LAD-0 LAD-1-LAD-7 LAN-0 LAN-1-LAN-7 LC LNO-0 LNO-1-LNO-7 LOF LOR-0 LOR-1-LOR-7 LPC-0 LPC-1-LPC-12 LPR-0 LPR-1-LPR-12 LR-0 LR-1-LR-7 LT-0 LT-1-LT-7 LX-0 LX-1-LX-8 LXO-0 LXO-1-LXO-7 LY-0 LY-1-LY-7 = led:LED: LED OSRAM: - CHIPLED LG R971, LG N971, LY N971, LG Q971, LY Q971, LO R971, LY R971 LH N974, LH R974 LS Q976, LO Q976, LY Q976 LO Q996 - Hyper CHIPLED LW Q18S LB Q993, LB Q99A, LB R99A - SideLED LS A670, LO A670, LY A670, LG A670, LP A670 LB A673, LV A673, LT A673, LW A673 LH A674 LY A675 LS A676, LA A676, LO A676, LY A676, LW A676 LS A679, LY A679, LG A679 - Hyper Micro SIDELED® LS Y876, LA Y876, LO Y876, LY Y876 LT Y87S - SmartLED LW L88C, LW L88S LB L89C, LB L89S, LG L890 LS L89K, LO L89K, LY L89K LS L896, LA L896, LO L896, LY L896 - TOPLED LS T670, LO T670, LY T670, LG T670, LP T670 LSG T670, LSP T670, LSY T670, LOP T670, LYG T670 LG T671, LOG T671, LSG T671 LB T673, LV T673, LT T673, LW T673 LH T674 LS T676, LA T676, LO T676, LY T676, LB T676, LH T676, LSB T676, LW T676 LB T67C, LV T67C, LT T67C, LS T67K, LO T67K, LY T67K, LW E67C LS E67B, LA E67B, LO E67B, LY E67B, LB E67C, LV E67C, LT E67C LW T67C LS T679, LY T679, LG T679 LS T770, LO T770, LY T770, LG T770, LP T770 LB T773, LV T773, LT T773, LW T773 LH T774 LS E675, LA E675, LY E675, LS T675 LS T776, LA T776, LO T776, LY T776, LB T776 LHGB T686 LT T68C, LB T68C - Hyper Mini TOPLED® LB M676 - Mini TOPLED Santana® LG M470 LS M47K, LO M47K, LY M47K Source: http://www.osram.convergy.de LUXEON: - LUMILED® LXK2-PW12-R00, LXK2-PW12-S00, LXK2-PW14-U00, LXK2-PW14-V00 LXK2-PM12-R00, LXK2-PM12-S00, LXK2-PM14-U00 LXK2-PE12-Q00, LXK2-PE12-R00, LXK2-PE12-S00, LXK2-PE14-T00, LXK2-PE14-U00 LXK2-PB12-K00, LXK2-PB12-L00, LXK2-PB12-M00, LXK2-PB14-N00, LXK2-PB14-P00, LXK2-PB14-Q00 LXK2-PR12-L00, LXK2-PR12-M00, LXK2-PR14-Q00, LXK2-PR14-R00 LXK2-PD12-Q00, LXK2-PD12-R00, LXK2-PD12-S00 LXK2-PH12-R00, LXK2-PH12-S00 LXK2-PL12-P00, LXK2-PL12-Q00, LXK2-PL12-R00 Source: www.luxeon.com KINGBRIGHT: KA-3528ASYC Source: www.kingbright.com
NOH NOL = 74ttl-din:74*04: Hex INVERTER
ORH ORL = 74ttl-din:74*32: Quad 2-input OR gate
PC0 PC1-PC3 = 74ttl-din:74*193: Synchronus 4-bit up down COUNTER
RA-0 RA-1-RA-7 RAD-0 RAD-1-RAD-7 RAN-0 RAN-1-RAN-7 RC RNO-0 RNO-1-RNO-7 ROF ROR-0 ROR-1-ROR-7 RPC-0 RPC-1-RPC-12 RPR-0 RPR-1-RPR-12 RR-0 RR-1-RR-7 RT-0 RT-1-RT-7 RX-0 RX-1-RX-8 RXO-0 RXO-1-RXO-7 RY-0 RY-1-RY-7 = rcl:R-EU_: RESISTOR, European symbol; SPICEPREFIX: R
ROM = memory-nec:28C64C: MEMORY; MPN: AT28C64B-15PU; OC_FARNELL: 1095784; OC_NEWARK: 96K6557
TH TL XOH XOL = 74ttl-din:74*86: Quad 2-input EXCLUSIV-OR gate
ZL = 74ttl-din:74*02: Quad 2-input NOR gate